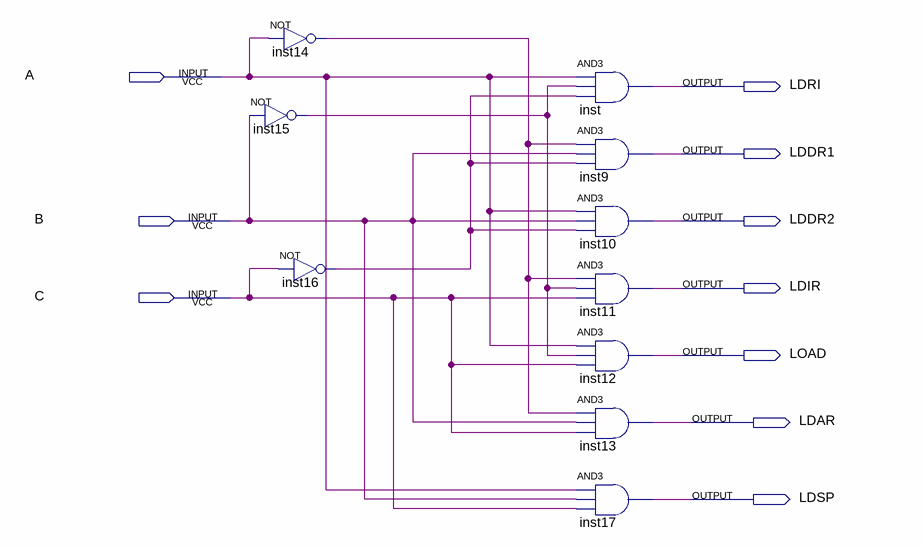
[diagram p0: schematic sheet]
// Quartus schematic decodea.bdf as structural Verilog: 10 symbols, 10 pins
module decodea (
  input  A,
  input  B,
  input  C,
  output LDRI,
  output LDDR1,
  output LDDR2,
  output LDIR,
  output LOAD,
  output LDAR,
  output LDSP
);

  wire inst14_out, inst15_out, inst16_out;

  not inst14 (inst14_out, A);
  not inst15 (inst15_out, B);
  not inst16 (inst16_out, C);
  and inst (LDRI, A, inst15_out, inst16_out);
  and inst9 (LDDR1, inst14_out, B, inst16_out);
  and inst10 (LDDR2, A, B, inst16_out);
  and inst11 (LDIR, inst14_out, inst15_out, C);
  and inst12 (LOAD, A, inst15_out, C);
  and inst13 (LDAR, inst14_out, B, C);
  and inst17 (LDSP, A, B, C);
endmodule
